# EAGLE design room_interface (EAGLE 6.4)

## Sheet 1 of 3
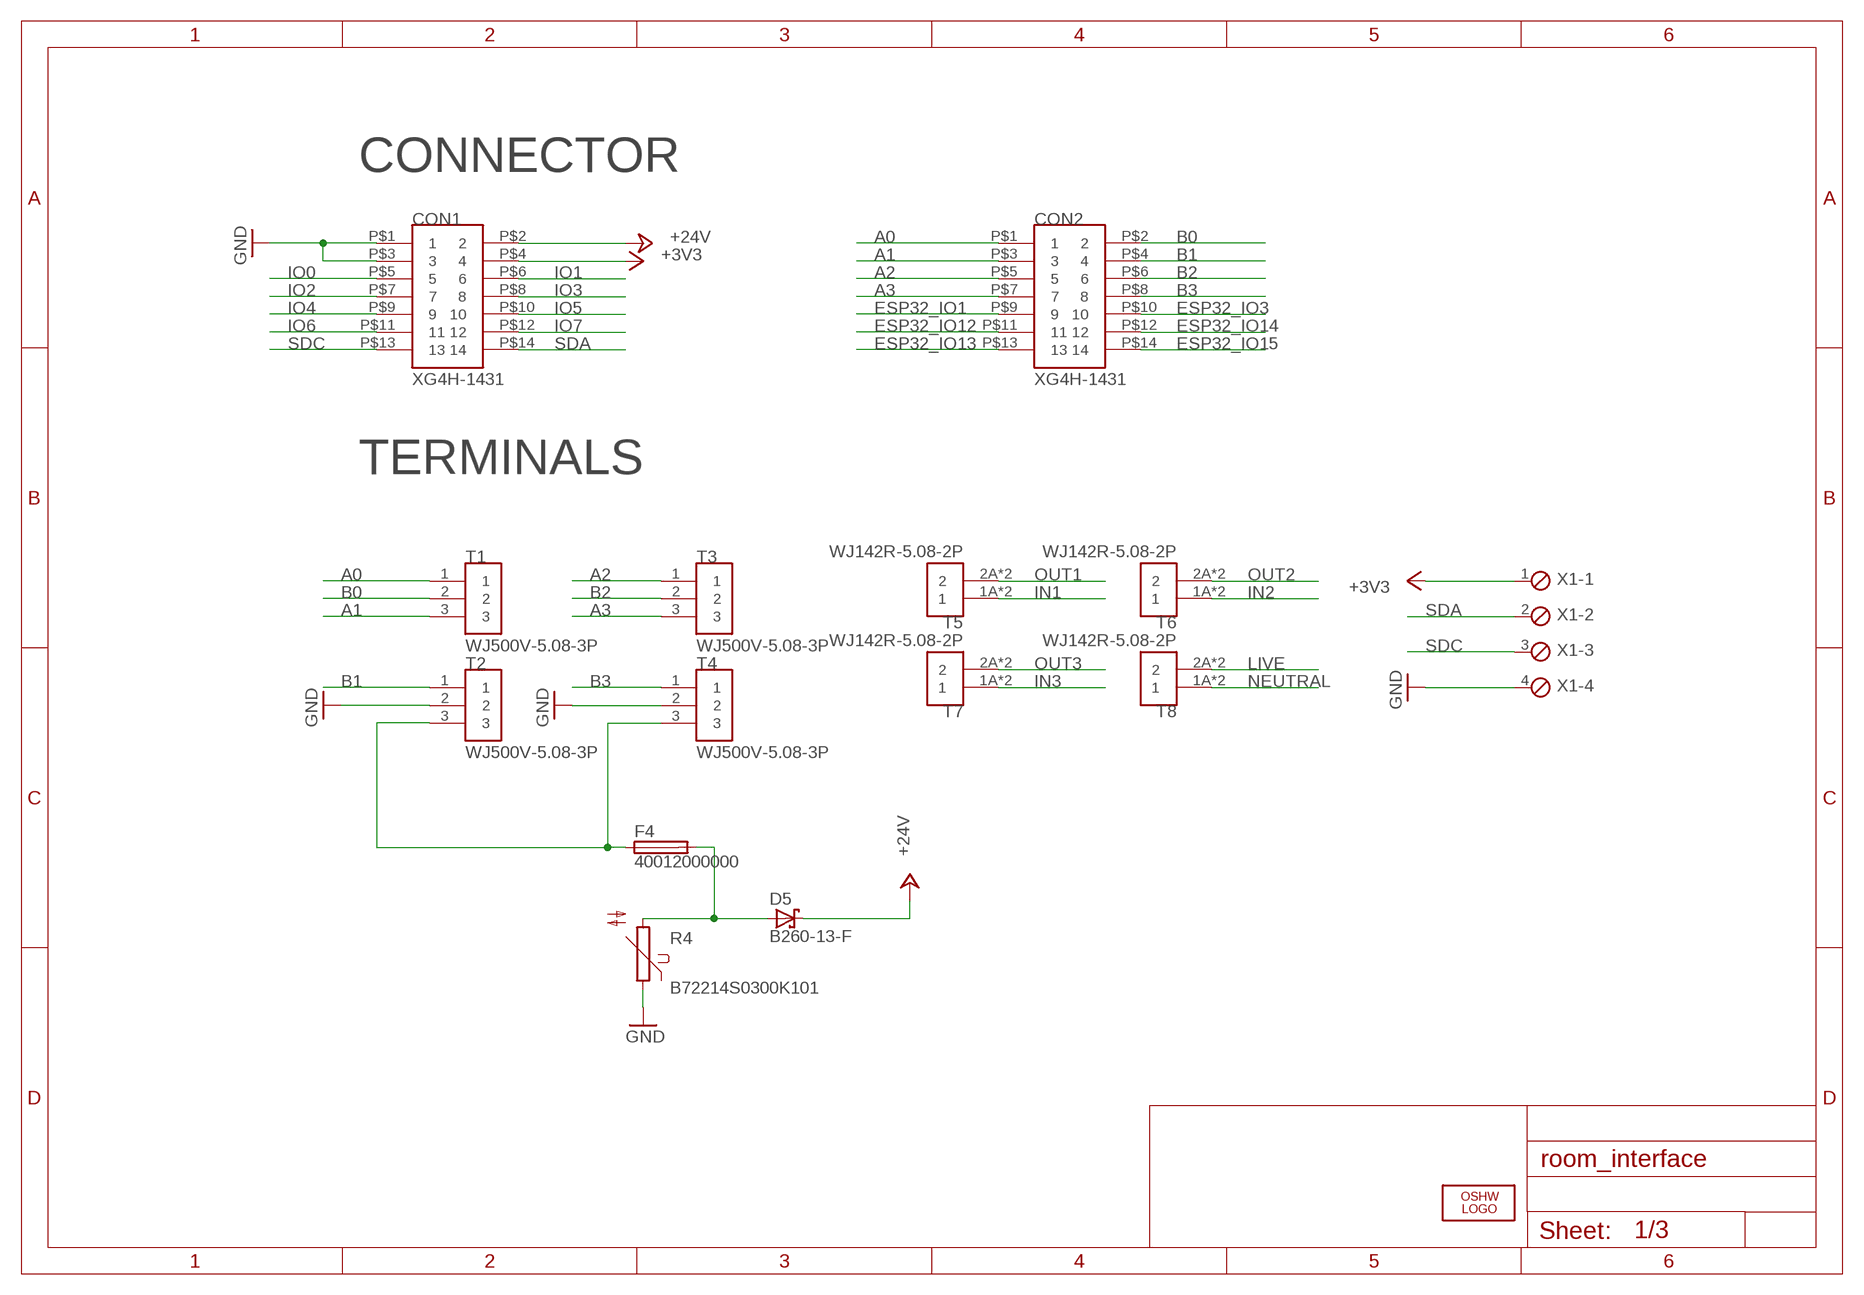
[diagram p0: schematic, sheet 1]

### Parts
CON1  XG4H-1431  [XG4H-1431]
CON2  XG4H-1431  [XG4H-1431]
D5  B260-13-F  MBRS130LT3  [SMB]
F4  40012000000  [400]
LOGO1  OSHW_LOGO_FILLX0350-NT  [OSHW_FILLX350_NOTEXT]
R4  B72214S0300K101  S14K300  [S14K300]
T1  WJ500V-5.08-3P  [WJ500V-5.08-3P]
T2  WJ500V-5.08-3P  [WJ500V-5.08-3P]
T3  WJ500V-5.08-3P  [WJ500V-5.08-3P]
T4  WJ500V-5.08-3P  [WJ500V-5.08-3P]
T5  WJ142R-5.08-2P  [WJ142R.5.08-2P]
T6  WJ142R-5.08-2P  [WJ142R.5.08-2P]
T7  WJ142R-5.08-2P  [WJ142R.5.08-2P]
T8  WJ142R-5.08-2P  [WJ142R.5.08-2P]
X1  MPT4  [4POL254]

### Nets
+3V3: CON1.P$4 X1.1 ; also sheet 3
+24V: CON1.P$2 D5.C ; also sheet 2
A0: CON2.P$1 T1.1
A1: CON2.P$3 T1.3
A2: CON2.P$5 T3.1
A3: CON2.P$7 T3.3
B0: CON2.P$2 T1.2
B1: CON2.P$4 T2.1
B2: CON2.P$6 T3.2
B3: CON2.P$8 T4.1
ESP32_IO1: CON2.P$9
ESP32_IO3: CON2.P$10
ESP32_IO12: CON2.P$11
ESP32_IO13: CON2.P$13
ESP32_IO14: CON2.P$12
ESP32_IO15: CON2.P$14
GND: CON1.P$1 CON1.P$3 R4.1 T2.2 T4.2 X1.4 ; also sheet 2,3
IN1: T5.1A T5.1B ; also sheet 3
IN2: T6.1A T6.1B ; also sheet 3
IN3: T7.1A T7.1B ; also sheet 3
IO0: CON1.P$5 ; also sheet 2
IO1: CON1.P$6 ; also sheet 2
IO2: CON1.P$7 ; also sheet 2
IO3: CON1.P$8
IO4: CON1.P$9
IO5: CON1.P$10 ; also sheet 3
IO6: CON1.P$11 ; also sheet 3
IO7: CON1.P$12 ; also sheet 3
LIVE: T8.2A T8.2B ; also sheet 2
N$4: D5.A F4.P$2 R4.2
N$6: F4.P$1 T2.3 T4.3
NEUTRAL: T8.1A T8.1B ; also sheet 3
OUT1: T5.2A T5.2B ; also sheet 2
OUT2: T6.2A T6.2B ; also sheet 2
OUT3: T7.2A T7.2B ; also sheet 2
SDA: CON1.P$14 X1.2
SDC: CON1.P$13 X1.3

### Notes on the sheet
- CONNECTOR
- TERMINALS

## Sheet 2 of 3
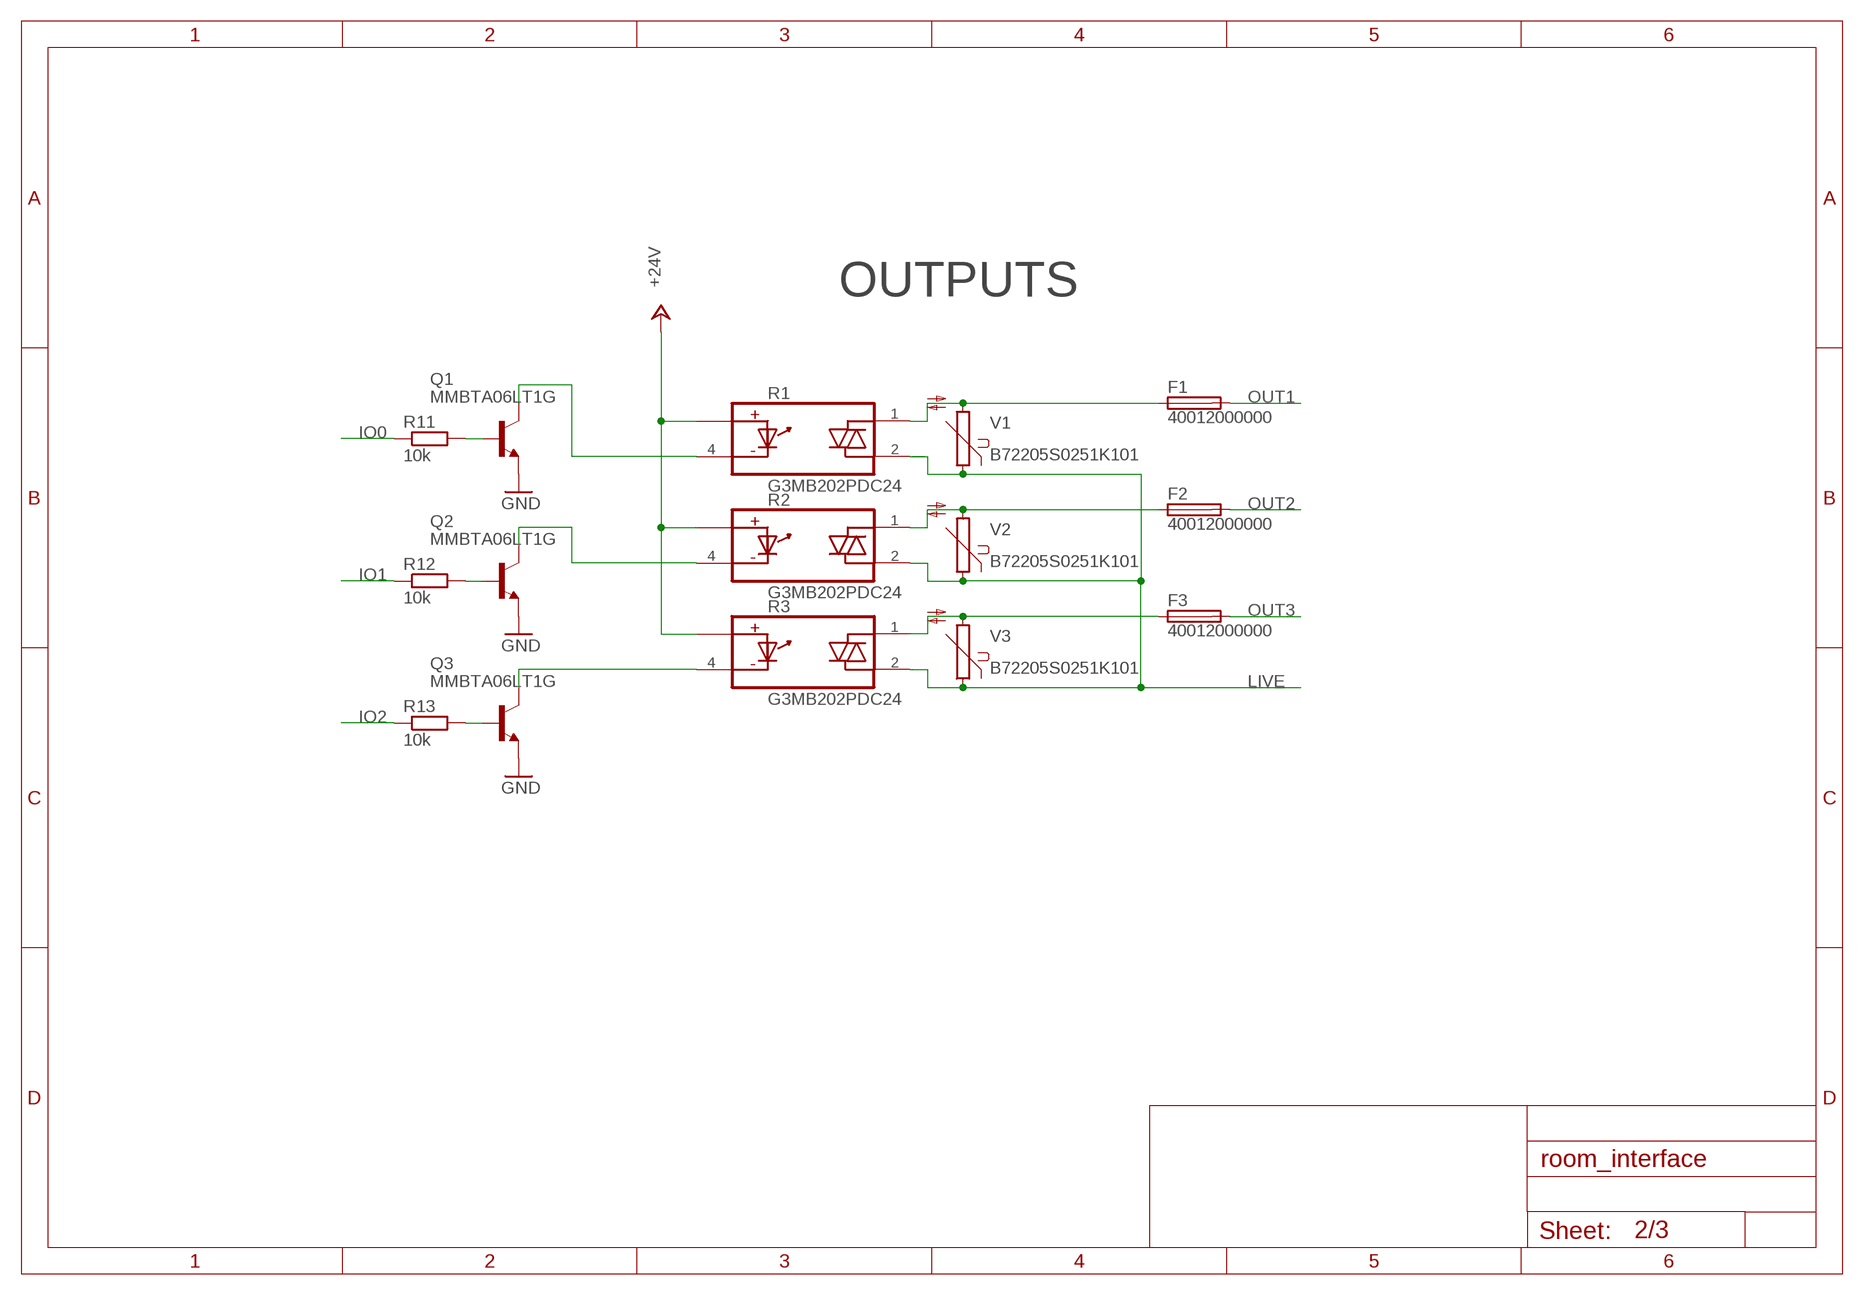
[diagram p1: schematic, sheet 2]

### Parts
F1  40012000000  [400]
F2  40012000000  [400]
F3  40012000000  [400]
Q1  MMBTA06LT1G  BC849SMD  [SOT23-BEC]
Q2  MMBTA06LT1G  BC849SMD  [SOT23-BEC]
Q3  MMBTA06LT1G  BC849SMD  [SOT23-BEC]
R1  G3MB202PDC24  RELAY_G3MB202PDC5  [RELAY_G3MB202PDC12]
R2  G3MB202PDC24  RELAY_G3MB202PDC5  [RELAY_G3MB202PDC12]
R3  G3MB202PDC24  RELAY_G3MB202PDC5  [RELAY_G3MB202PDC12]
R11  10k  R-EU_R1206  [R1206]
R12  10k  R-EU_R1206  [R1206]
R13  10k  R-EU_R1206  [R1206]
V1  B72205S0251K101  S05K250  [S05K250]
V2  B72205S0251K101  S05K250  [S05K250]
V3  B72205S0251K101  S05K250  [S05K250]

### Nets
+24V: R1.3(IN+) R2.3(IN+) R3.3(IN+) ; also sheet 1
GND: Q1.E Q2.E Q3.E ; also sheet 1,3
IO0: R11.1 ; also sheet 1
IO1: R12.1 ; also sheet 1
IO2: R13.1 ; also sheet 1
LIVE: R1.2(OUT2) R2.2(OUT2) R3.2(OUT2) V1.1 V2.1 V3.1 ; also sheet 1
N$1: F1.P$1 R1.1(OUT1) V1.2
N$2: F2.P$1 R2.1(OUT1) V2.2
N$3: F3.P$1 R3.1(OUT1) V3.2
N$12: Q1.B R11.2
N$13: Q1.C R1.4(IN-)
N$15: Q2.B R12.2
N$16: Q2.C R2.4(IN-)
N$18: Q3.B R13.2
N$19: Q3.C R3.4(IN-)
OUT1: F1.P$2 ; also sheet 1
OUT2: F2.P$2 ; also sheet 1
OUT3: F3.P$2 ; also sheet 1

### Notes on the sheet
- OUTPUTS

## Sheet 3 of 3
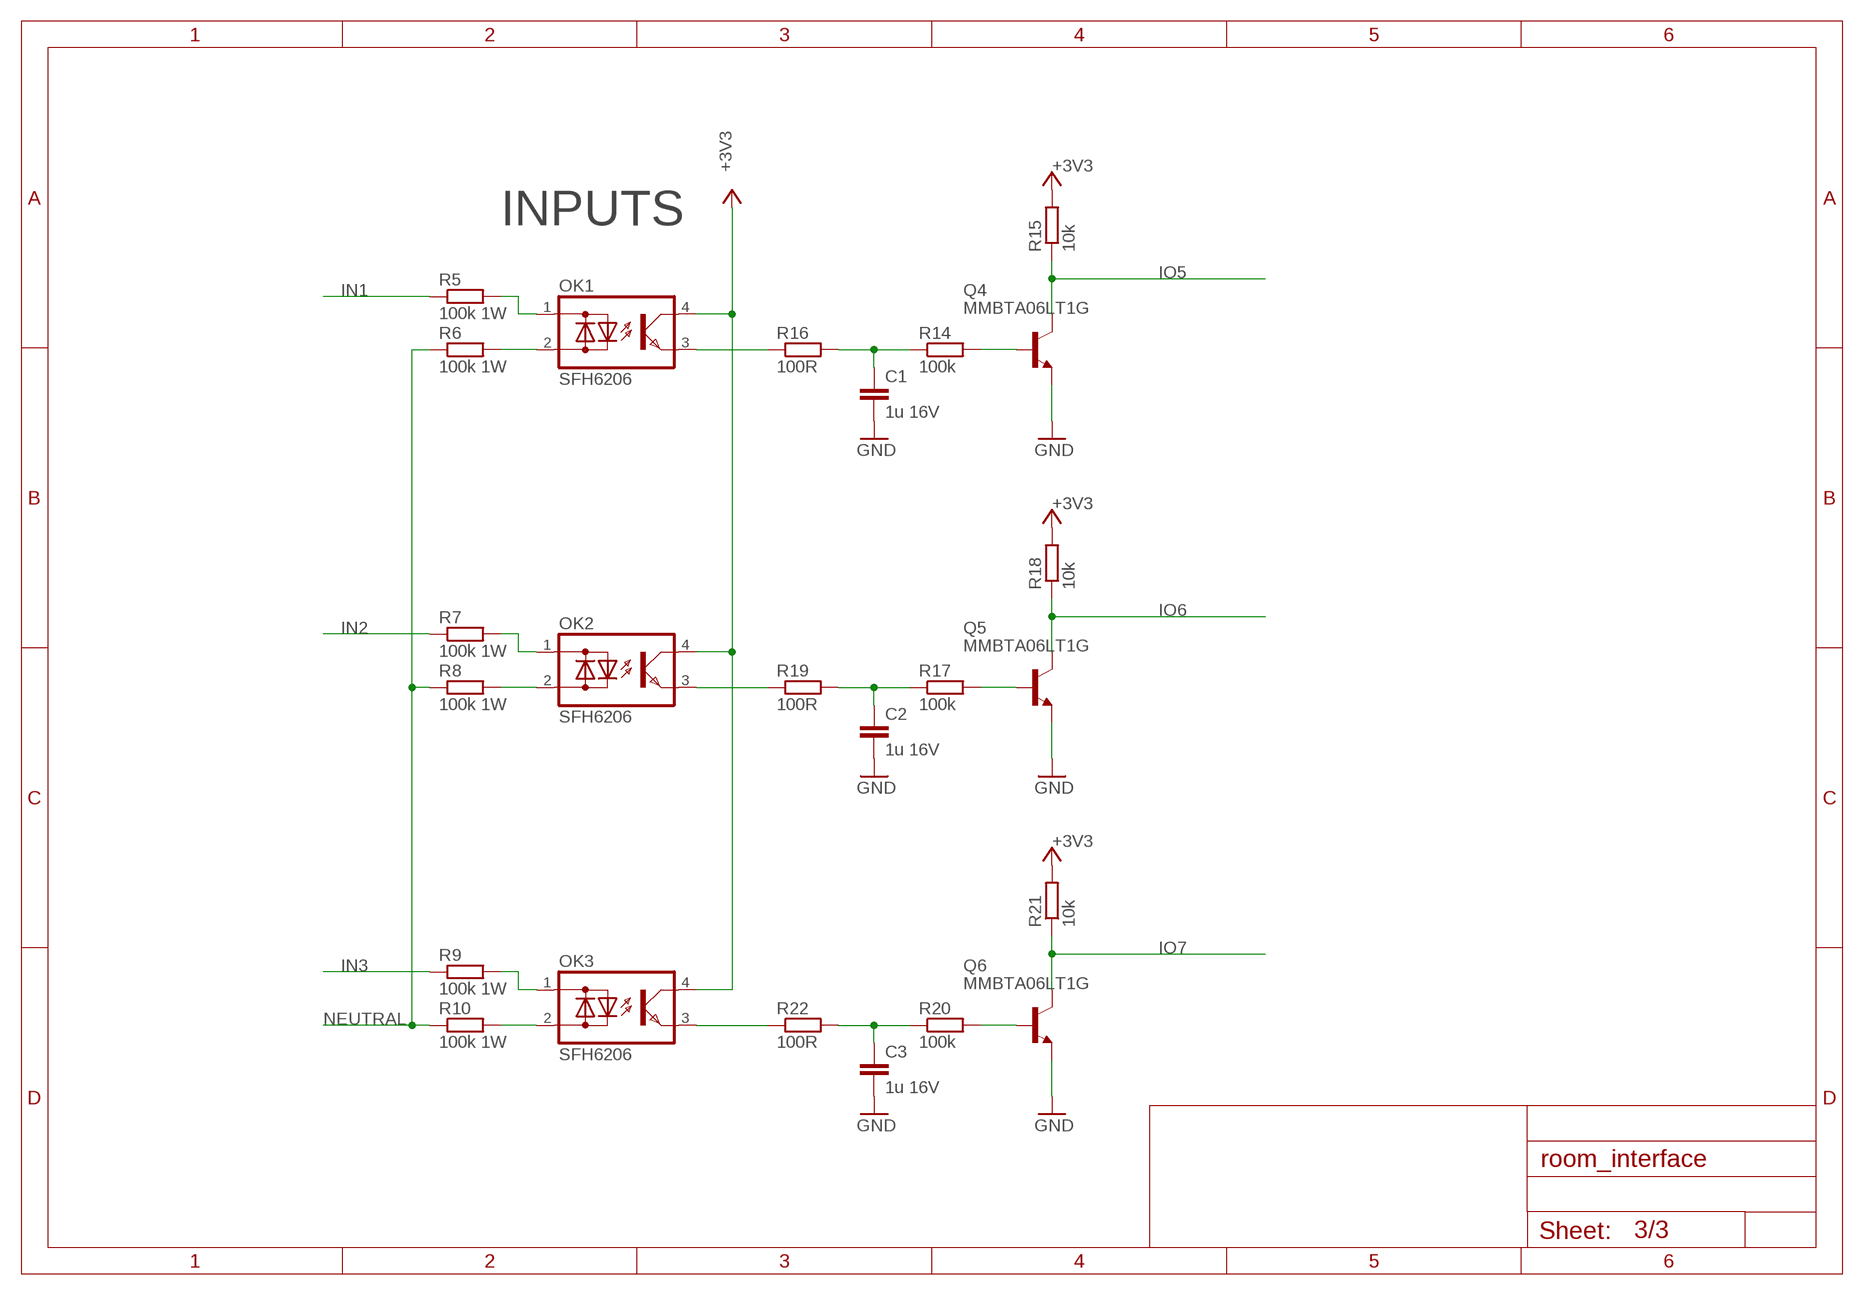
[diagram p2: schematic, sheet 3]

### Parts
C1  1u 16V  C-EUC0805  [C0805]
C2  1u 16V  C-EUC0805  [C0805]
C3  1u 16V  C-EUC0805  [C0805]
OK1  SFH6206  [DIL4-SMD]
OK2  SFH6206  [DIL4-SMD]
OK3  SFH6206  [DIL4-SMD]
Q4  MMBTA06LT1G  BC849SMD  [SOT23-BEC]
Q5  MMBTA06LT1G  BC849SMD  [SOT23-BEC]
Q6  MMBTA06LT1G  BC849SMD  [SOT23-BEC]
R5  100k 1W  R-EU_R2010  [R2010]
R6  100k 1W  R-EU_R2010  [R2010]
R7  100k 1W  R-EU_R2010  [R2010]
R8  100k 1W  R-EU_R2010  [R2010]
R9  100k 1W  R-EU_R2010  [R2010]
R10  100k 1W  R-EU_R2010  [R2010]
R14  100k  R-EU_R1206  [R1206]
R15  10k  R-EU_R1206  [R1206]
R16  100R  R-EU_R1206  [R1206]
R17  100k  R-EU_R1206  [R1206]
R18  10k  R-EU_R1206  [R1206]
R19  100R  R-EU_R1206  [R1206]
R20  100k  R-EU_R1206  [R1206]
R21  10k  R-EU_R1206  [R1206]
R22  100R  R-EU_R1206  [R1206]

### Nets
+3V3: OK1.4(C) OK2.4(C) OK3.4(C) R15.2 R18.2 R21.2 ; also sheet 1
GND: C1.2 C2.2 C3.2 Q4.E Q5.E Q6.E ; also sheet 1,2
IN1: R5.1 ; also sheet 1
IN2: R7.1 ; also sheet 1
IN3: R9.1 ; also sheet 1
IO5: Q4.C R15.1 ; also sheet 1
IO6: Q5.C R18.1 ; also sheet 1
IO7: Q6.C R21.1 ; also sheet 1
N$5: OK1.2(AC2) R6.2
N$7: OK1.1(AC1) R5.2
N$8: OK2.1(AC1) R7.2
N$9: OK2.2(AC2) R8.2
N$10: OK3.1(AC1) R9.2
N$11: OK3.2(AC2) R10.2
N$17: Q4.B R14.2
N$20: OK1.3(E) R16.1
N$21: C1.1 R14.1 R16.2
N$23: Q5.B R17.2
N$24: OK2.3(E) R19.1
N$25: C2.1 R17.1 R19.2
N$27: Q6.B R20.2
N$28: OK3.3(E) R22.1
N$29: C3.1 R20.1 R22.2
NEUTRAL: R6.1 R8.1 R10.1 ; also sheet 1

### Notes on the sheet
- INPUTS

## Library data of the parts
C1-C3 = rcl:C-EU: CAPACITOR, European symbol
CON1 CON2 = parts:XG4H-1431
D5 = diode:MBRS130LT3: Schottky Power Rectifier Source: http://www.onsemi.com/pub/Collateral/MBRS130LT3-D.PDF
F1-F4 = 400XXX0000:40012000000
LOGO1 = ohw-logo:OSHW_LOGO_FILL
OK1-OK3 = optocoupler:SFH620: Optocoupler, Phototransistor Output, AC Input Source: http://www.vishay.com/docs/83675/sfh620.pdf; MF: VISHAY/TELEFUNKEN; MPN: SFH6206-3; OC_FARNELL: 1469585; OC_NEWARK: 58K2214
Q1-Q6 = transistor-npn:BC849*: NPN Transistor
R1-R3 = RELAY_G3MB202PDC5_snapEDA:RELAY_G3MB202PDC5
R4 = varistor:S14K300: VARISTOR
R5-R22 = rcl:R-EU_: RESISTOR, European symbol
T1-T4 = parts:WJ500V-5.08-3P
T5-T8 = parts:WJ142R-5.08-2P
V1-V3 = varistor:S05K250: VARISTOR
X1 = con-phoenix-254:MPT4: PHOENIX CONNECTOR; OC_FARNELL: unknown; OC_NEWARK: unknown

## Board
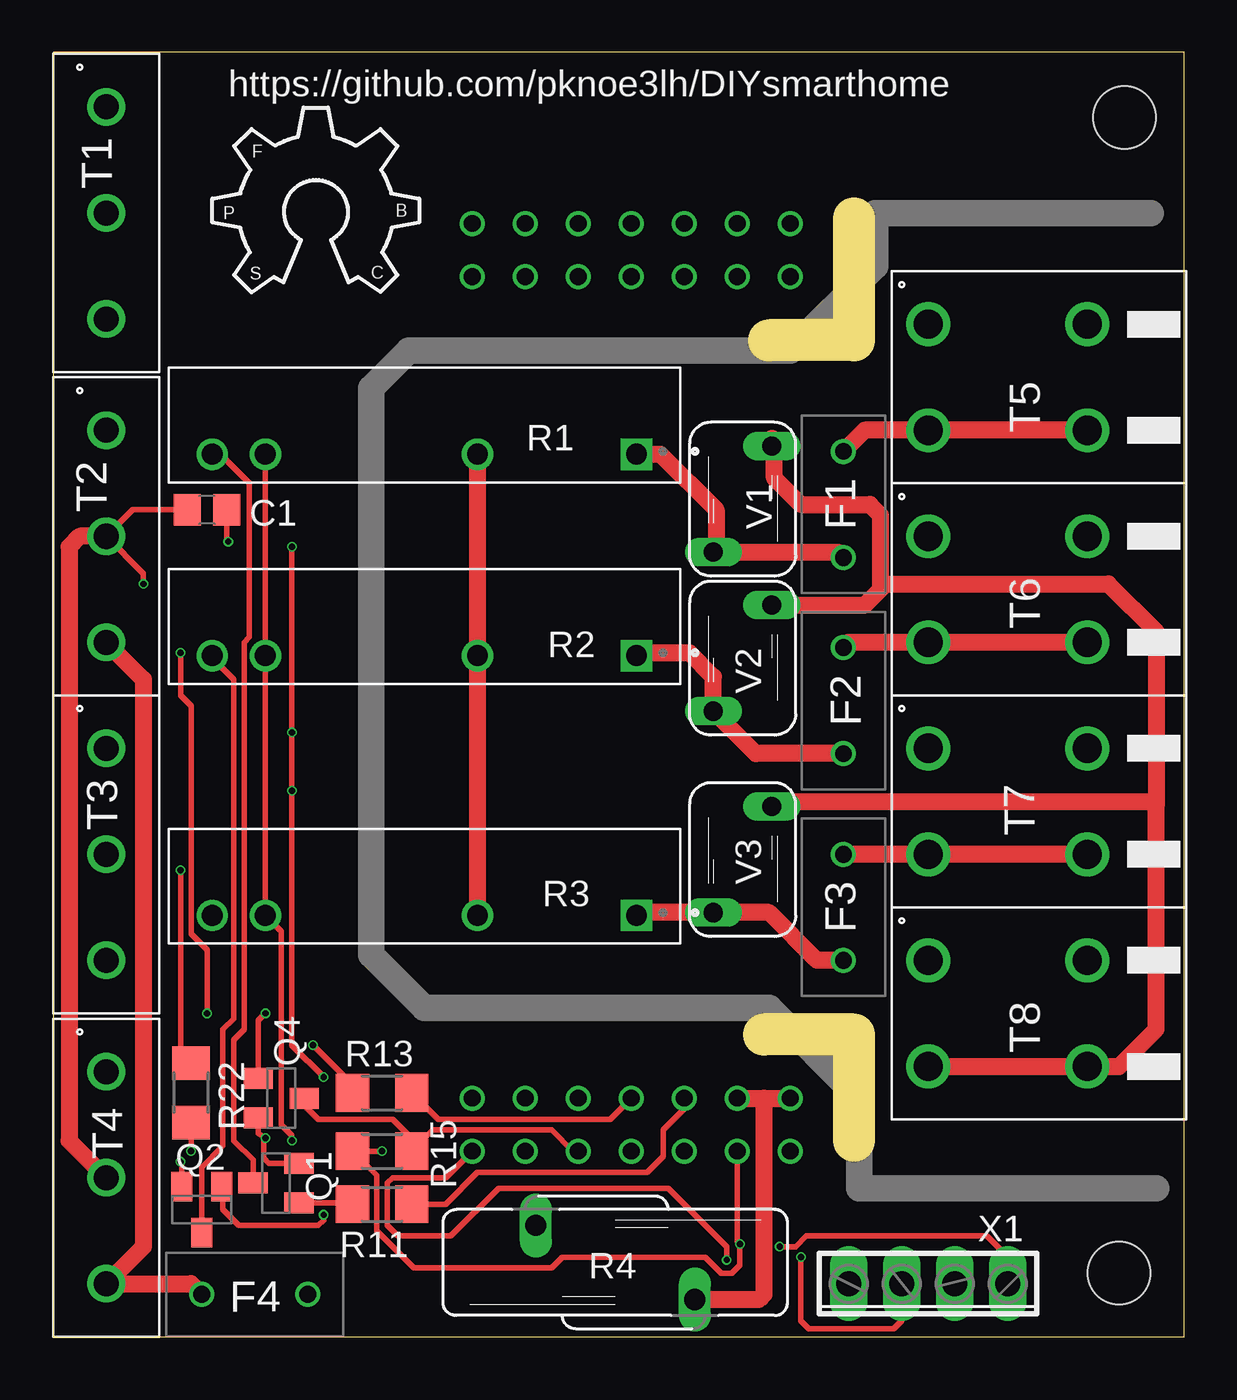
[diagram p3: board, top side]
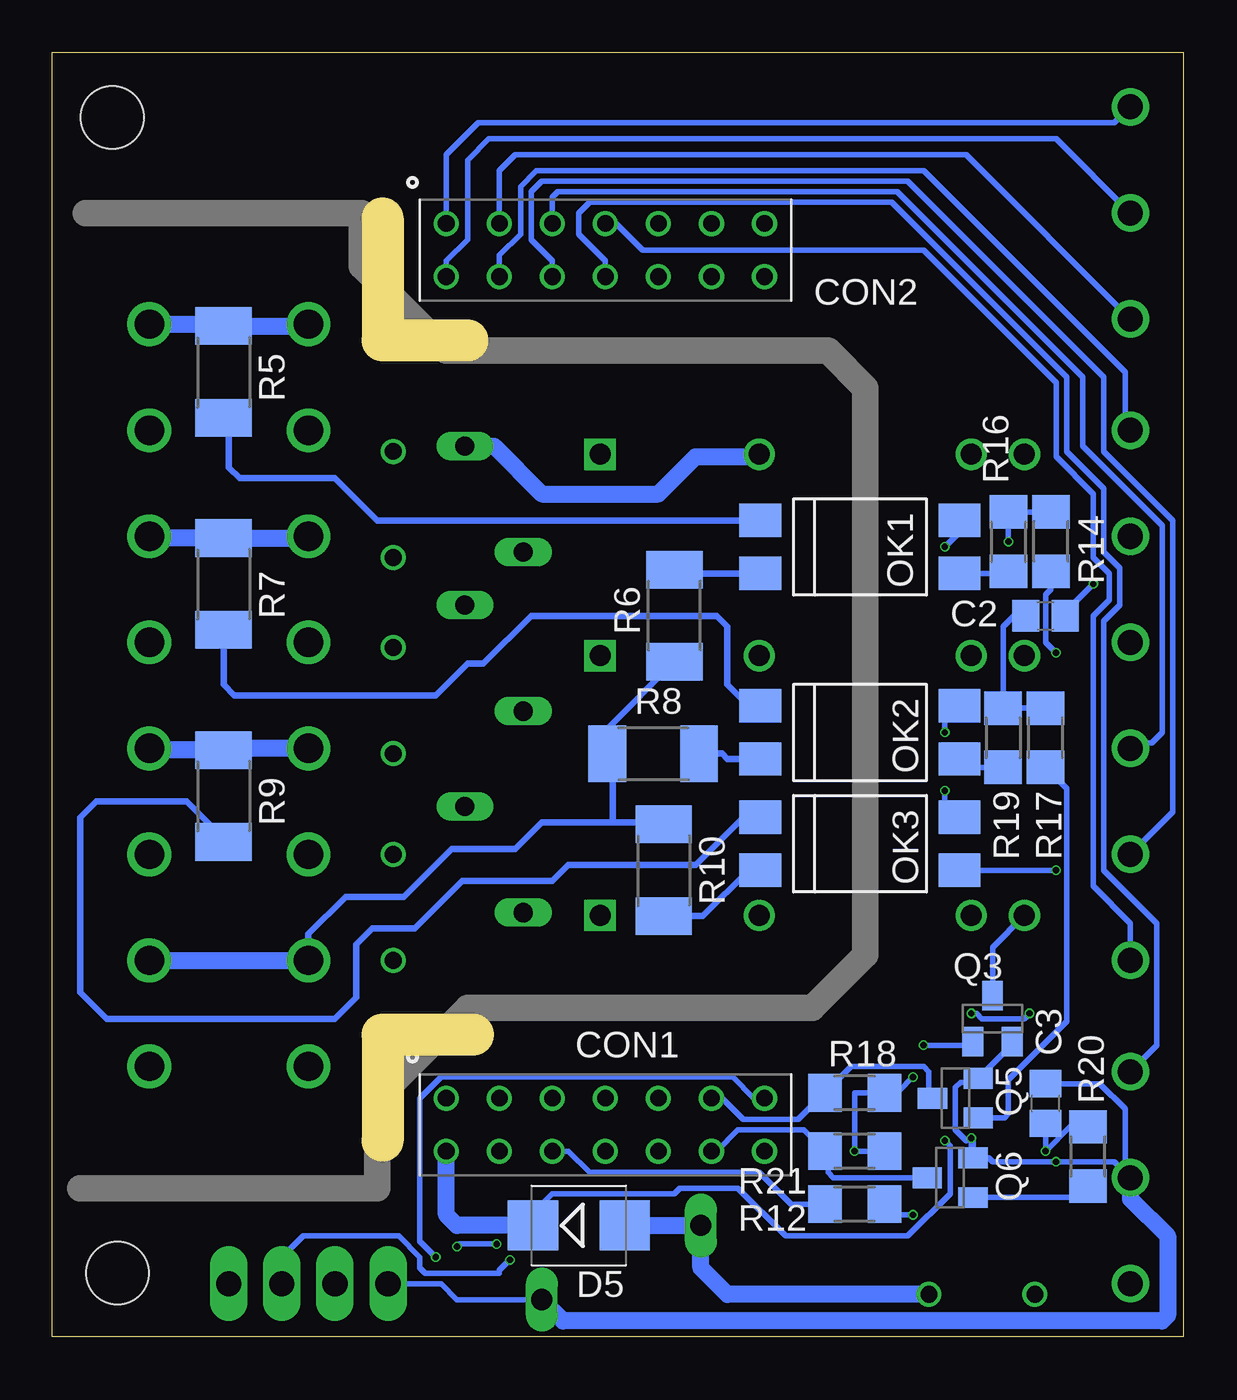
[diagram p4: board, bottom side, seen from below]

Size 54.19 x 61.55 mm. Coordinates in mm from the lower left corner, seen from the top.
Outline: 0,0 54.19,0 54.19,61.55 0,61.55 0,0
Copper layers (1*16): Top 0.035559375mm / dielectric 1.6mm / Bottom 0.035559375mm
Design rules "jlcpcb2layer": minimum track width 5mil, minimum drill 12mil, track to track 5mil, track to pad 5mil, pad to pad 5mil, via to via 5mil, smd to smd 5mil, copper to edge 8mil, drill to drill 6mil, minimum pad ring 5mil, minimum via ring 3mil, stop-mask expansion 2.5mil, vias tented up to drill 0mil, thermal gap 10mil
Holes 3 mm at 51.31,58.42 51.05,3.05
Milling: 4 lines

### Footprints (pad centres in the part's own frame; a part is rotated, then mirrored left to right if it is on the bottom)
C0805 = smd 1.3 x 1.5: 1 -0.95,0; 2 0.95,0
XG4H-1431 = drill 0.8: P$1 -7.62,1.27; P$2 -7.62,-1.27; P$3 -5.08,1.27; P$4 -5.08,-1.27; P$5 -2.54,1.27; P$6 -2.54,-1.27; P$7 0,1.27; P$8 0,-1.27; P$9 2.54,1.27; P$10 2.54,-1.27; P$11 5.08,1.27; P$12 5.08,-1.27; P$13 7.62,1.27; P$14 7.62,-1.27
SMB = smd 2.4 x 2.4: A 2.2,0; C -2.2,0
400 = drill 0.8: P$1 -2.54,0; P$2 2.54,0
DIL4-SMD = smd 1.6 x 2: 1 -1.27,-4.77; 2 1.27,-4.77; 3 1.27,4.77; 4 -1.27,4.77
SOT23-BEC = smd 1 x 1.4: B -0.95,-1.1; C 0,1.1; E 0.95,-1.1
RELAY_G3MB202PDC12 = drill 1 square: 1 -10.16,1.4 | drill 1: 2 -2.54,1.4; 3 7.62,1.4; 4 10.16,1.4
S14K300 = drill 1.016 long: 1 -1.778,-3.81; 2 1.778,3.81
R2010 = smd 1.8 x 2.7: 1 -2.2,0; 2 2.2,0
R1206 = smd 1.6 x 1.803: 1 -1.422,0; 2 1.422,0
WJ500V-5.08-3P = drill 1.2: 1 -5.08,0; 2 0,0; 3 5.08,0
WJ142R.5.08-2P = drill 1.4: 1A -2.54,-3.81; 1B -2.54,3.81; 2A 2.54,-3.81; 2B 2.54,3.81
S05K250 = drill 0.914 long: 1 -1.397,-2.54; 2 1.397,2.54
4POL254 = drill 1.2 long: 1 -3.81,0; 2 -1.27,0; 3 1.27,0; 4 3.81,0

### Placement (x,y rotation side)
C1  7.37,39.62 180 top
C2  6.6,34.54 0 bottom
C3  6.6,11.18 90 bottom
CON1  27.69,10.16 0 bottom
CON2  27.69,52.07 0 bottom
D5  28.96,5.33 0 bottom
F1  37.85,39.88 90 top
F2  37.85,30.48 90 top
F3  37.85,20.57 90 top
F4  9.65,2.03 0 top
LOGO1  7.62,50.04 0 top
OK1  15.49,37.85 270 bottom
OK2  15.49,28.96 270 bottom
OK3  15.49,23.62 270 bottom
Q1  10.67,7.37 90 top
Q2  7.11,6.1 180 top
Q3  9.14,15.24 0 bottom
Q4  10.92,11.43 270 top
Q5  10.92,11.43 90 bottom
Q6  11.18,7.62 90 bottom
R1  17.78,43.69 180 top
R2  17.78,34.04 180 top
R3  17.78,21.59 180 top
R4  26.92,3.56 90 top
R5  45.97,46.23 270 bottom
R6  24.38,34.54 90 bottom
R7  45.97,36.07 270 bottom
R8  25.4,27.94 0 bottom
R9  45.97,25.91 270 bottom
R10  24.89,22.35 270 bottom
R11  15.75,6.35 180 top
R12  15.75,6.35 0 bottom
R13  15.75,11.68 180 top
R14  6.35,38.1 270 bottom
R15  15.75,8.89 180 top
R16  8.38,38.1 90 bottom
R17  6.6,28.7 270 bottom
R18  15.75,11.68 0 bottom
R19  8.64,28.7 90 bottom
R20  4.57,8.64 270 bottom
R21  15.75,8.89 0 bottom
R22  6.6,11.68 270 top
T1  2.54,53.85 270 top
T2  2.54,38.35 270 top
T3  2.54,23.11 270 top
T4  2.54,7.62 270 top
T5  45.72,45.97 270 top
T6  45.72,35.81 270 top
T7  45.72,25.65 270 top
T8  45.72,15.49 270 top
V1  33.02,40.13 180 top
V2  33.02,32.51 180 top
V3  33.02,22.86 180 top
X1  41.91,2.54 180 top

### Tracks (layer width: path | path; a pad name or v marks a point on that pad's centre or on a via)
+3V3  (via drill 0.3)
  Top 0.254: v34.8,4.32 35.56,4.32 36.07,4.83 44.7,4.83 45.97,3.56 45.97,2.79 X1.1 | CON1.P$4 32.77,4.57 v32.89,4.44 32.89,3.43 32.51,3.05 32,3.05 31.24,3.81 24.38,3.81 23.88,3.3 17.27,3.3 15.49,5.08 15.49,7.72 R21.2 v15.75,8.89 | v11.43,37.85 v11.43,28.96 11.43,26.92 v11.43,26.16 11.43,13.97 v12.95,12.45
  Bottom 0.254: v32.89,4.44 34.67,4.44 v34.8,4.32 | R21.2 v15.75,8.89 15.75,11.68 R18.2 14.22,11.79 13.61,11.79 v12.95,12.45 | OK1.4 10.72,38.55 v11.43,37.85 | v11.43,28.96 11.43,29.52 OK2.4 | v11.43,26.16 11.43,25.6 OK3.4
+24V  (via drill 0.3)
  Top 0.254: v11.43,9.4 11.43,9.65 10.92,10.16 10.92,19.43 R3.3 R2.3 R1.3
  Bottom 0.254: D5.C 31.16,5.93 30.23,6.86 24.38,6.86 24.13,7.11 21.34,7.11 19.05,4.83 13.21,4.83 11.18,6.86 11.18,9.14 v11.43,9.4
  Bottom 0.813: D5.C 34.8,5.33 35.31,5.84 CON1.P$2
A0
  Bottom 0.254: CON2.P$1 35.31,56.64 33.78,58.17 3.3,58.17 T1.1
A1
  Bottom 0.254: CON2.P$3 32.77,55.88 32,56.64 10.41,56.64 T1.3
A2
  Bottom 0.254: CON2.P$5 30.23,54.61 29.97,54.86 13.72,54.86 4.83,45.97 4.83,42.67 1.02,38.86 1.02,28.96 1.52,28.45 2.29,28.45 T3.1
A3
  Bottom 0.254: CON2.P$7 27.18,53.34 25.91,52.07 12.45,52.07 6.1,45.72 6.1,42.16 4.32,40.39 4.32,37.34 3.56,36.58 3.56,35.31 4.32,34.54 4.32,21.59 2.54,19.81 T3.3
B0
  Bottom 0.254: CON2.P$2 35.31,51.56 34.29,52.58 34.29,56.39 33.27,57.4 6.1,57.4 T1.2
B1
  Bottom 0.254: T2.1 2.79,43.69 2.79,46.23 12.45,55.88 30.99,55.88 31.75,55.12 31.75,52.83 32.77,51.82 CON2.P$4
B2
  Bottom 0.254: CON2.P$6 30.23,51.56 31.24,52.58 31.24,54.86 30.73,55.37 13.21,55.37 3.81,45.97 3.81,42.42 0.51,39.12 0.51,25.15 T3.2
B3
  Bottom 0.254: T4.1 1.27,13.97 1.27,19.81 3.81,22.35 3.81,34.29 3.05,35.05 3.05,36.83 3.81,37.59 3.81,40.64 5.59,42.42 5.59,45.97 13.97,54.36 28.45,54.36 28.96,53.85 28.96,52.83 27.69,51.56 CON2.P$8
GND  (via drill 0.3)
  Top 0.254: T2.2 2.54,38.1 | Q4.E 9.82,9.74 v10.16,9.53 10.08,9.44 Q6.E 10.33,8.32 Q1.E | Q2.E 6.16,8.32 v6.1,8.38 | C1.2 3.81,39.62 T2.2 | v4.32,36.07 4.32,36.58 T2.2
  Top 0.813: T2.2 1.27,38.35 0.76,37.85 0.76,9.4 T4.2 | CON1.P$3 34.04,11.43 | 34.04,11.43 CON1.P$1 | 34.04,11.43 34.04,2.03 33.78,1.78 R4.1
  Bottom 0.254: X1.4 35.56,2.54 34.8,1.78 R4.1 | v10.16,9.53 10.16,8.65 Q6.E | Q6.E 10.08,9.31 v10.16,9.53 | v10.16,9.53 10.41,9.4 10.92,9.91 10.92,11.94 10.67,12.19 10.01,12.19 Q5.E 8.19,14.01 Q3.E | Q6.E 9.33,8.57 9.14,8.38 v6.1,8.38 3.3,8.38 T4.2 2.79,7.87 2.79,10.92 4,12.13 C3.2 | C2.2 5.65,34.73 v4.32,36.07
  Bottom 0.813: T4.2 2.54,6.6 0.76,4.83 0.76,1.02 1.02,0.76 29.72,0.76 R4.1
IN1
  Bottom 0.813: T5.1B 46.06,48.51 R5.1 42,48.43 T5.1A
IN2
  Bottom 0.813: T6.1B 49.44,38.27 R7.1 42,38.27 T6.1A
IN3
  Bottom 0.813: T7.1A 45.89,28.19 R9.1 49.44,28.11 T7.1B
IO0
  Top 0.254: CON1.P$5 30.23,10.92 29.21,9.91 29.21,8.64 28.45,7.87 20.32,7.87 18.8,6.35 R11.1
IO1
  Bottom 0.254: CON1.P$6 29.46,8.89 28.45,7.87 20.32,7.87 18.8,6.35 R12.1
IO2
  Top 0.254: CON1.P$7 26.67,10.41 18.44,10.41 R13.1
IO5
  Top 0.254: CON1.P$10 24.89,8.89 23.88,9.91 18.19,9.91 R15.1 17.02,9.04 17.02,9.65 16.26,10.41 12.7,10.41 12.02,11.09 Q4.C
IO6
  Bottom 0.254: CON1.P$11 22.1,11.43 21.08,10.41 18.44,10.41 R18.1 15.9,12.95 12.45,12.95 12.19,12.7 12.19,11.6 Q5.C 12.02,11.77
IO7
  Bottom 0.254: CON1.P$12 22.35,8.89 21.34,9.91 18.19,9.91 R21.1 17.02,8.74 17.02,7.87 16.76,7.62 Q6.C
LIVE
  Top 0.813: R1.2 R2.2 R3.2 | T8.2A T8.2B 51.05,12.95 52.83,14.73 52.83,25.4 | 52.83,25.4 52.58,25.65 34.67,25.65 V3.1 | 34.42,43.05 V1.1 34.54,42.54 34.54,41.15 35.81,39.88 39.12,39.88 39.62,39.37 39.62,36.07 39.75,35.94 | 52.83,25.4 52.83,33.78 50.55,36.07 39.88,36.07 39.75,35.94 | V2.1 38.86,35.05 39.75,35.94
  Bottom 0.813: V1.1 33.02,42.67 30.73,40.39 25.15,40.39 23.37,42.16 20.44,42.16 R1.2
N$1
  Top 0.813: R1.1 29.09,42.29 31.75,39.62 31.75,37.72 V1.2 37.59,37.59 F1.P$1
N$2
  Top 0.813: F2.P$1 33.66,27.94 V2.2 31.62,31.62 30.48,32.77 28.07,32.77 R2.1
N$3
  Top 0.813: F3.P$1 36.58,18.03 34.29,20.32 V3.2 28.07,20.32 R3.1
N$4
  Bottom 0.813: D5.A R4.2 23.11,3.3 21.84,2.03 F4.P$2
N$5
  Bottom 0.305: OK1.2 24.22,36.58
  Bottom 0.813: 24.22,36.58 R6.2
N$6
  Top 0.813: T2.3 4.32,31.5 4.32,4.32 T4.3 6.6,2.54 F4.P$1
N$7
  Bottom 0.305: OK1.1 38.61,39.12 40.64,41.15 45.21,41.15 45.72,41.66 45.72,43.77
  Bottom 0.813: 45.72,43.77 R5.2
N$8
  Bottom 0.305: 20.83,30.23 21.84,31.24 21.84,34.04 22.35,34.54 31.24,34.54 33.53,32.26 34.29,32.26 35.43,31.11 35.56,30.99 35.81,30.73 45.47,30.73 45.97,31.24 R7.2
  Bottom 0.813: OK2.1 20.83,30.23
N$9
  Bottom 0.305: R8.2 22.1,27.94 21.84,27.69 OK2.2
N$10
  Bottom 0.305: OK3.1 21.08,24.89 23.37,22.61 29.46,22.61 30.23,21.84 34.54,21.84 36.83,19.56 38.86,19.56 39.62,18.8 39.62,16.26 40.64,15.24 51.56,15.24 52.83,16.51 52.83,24.89 52.07,25.65 47.75,25.65 45.97,23.88
  Bottom 0.813: R9.2 45.97,23.88
N$11
  Bottom 0.305: R10.2 23.03,20.15 20.83,22.35
  Bottom 0.813: 20.52,22.61 OK3.2 20.83,22.35
N$12
  Top 0.254: Q1.B 14.26,6.42 R11.2
N$13
  Top 0.254: Q1.C 9.57,8.47 8.64,9.4 8.64,14.22 9.14,14.73 9.14,33.27 9.4,33.53 9.4,40.89 8,42.29 R1.4
N$15  (via drill 0.3)
  Top 0.254: v12.95,5.84 12.95,5.59 12.7,5.33 8.89,5.33 8.13,6.1 8.13,7.13 Q2.B
  Bottom 0.254: R12.2 14.33,6.2 13.97,5.84 v12.95,5.84
N$16
  Top 0.254: R2.4 7.62,32.51 8.64,31.5 8.64,15.24 8.13,14.73 8.13,9.14 7.11,8.13 Q2.C
N$17  (via drill 0.3)
  Top 0.254: Q4.B 9.82,15.16 v10.16,15.49 | v7.37,15.49 7.37,18.54 6.6,19.3 6.6,30.23 6.1,30.73 v6.1,32.77
  Bottom 0.254: v10.16,15.49 9.91,15.49 9.65,15.24 7.62,15.24 v7.37,15.49 | R14.2 6.35,35.81 6.6,35.56 6.6,33.27 v6.1,32.77
N$18  (via drill 0.3)
  Top 0.254: R13.2 14.33,12.09 v12.45,13.97
  Bottom 0.254: v12.45,13.97 10.41,13.97 | 10.41,13.97 9.91,13.97 | Q3.B 10.24,14.14 10.41,13.97
N$19
  Bottom 0.254: Q3.C 9.14,18.67 R3.4
N$20
  Bottom 0.254: OK1.3 8.48,36.58 R16.1
N$21  (via drill 0.3)
  Top 0.254: C1.1 8.32,38.17 v8.38,38.1
  Bottom 0.254: R14.1 R16.2 v8.38,38.1
N$23
  Bottom 0.254: Q5.B 8.57,10.48 8.38,10.67 8.38,12.32 5.59,15.11 5.59,26.26 R17.2
N$24
  Bottom 0.254: R19.1 10.32,27.28 OK2.3
N$25
  Bottom 0.254: R17.1 R19.2 8.64,34.04 8.13,34.54 C2.1
N$27
  Bottom 0.254: Q6.B 5.12,6.67 R20.2
N$28  (via drill 0.3)
  Top 0.254: v6.1,22.35 6.1,13.61 R22.1
  Bottom 0.254: v6.1,22.35 OK3.3
N$29  (via drill 0.3)
  Top 0.254: v6.6,8.89 R22.2 6.6,10.48
  Bottom 0.254: R20.1 5.44,10.06 v6.6,8.89 C3.1
NEUTRAL
  Bottom 0.305: R8.1 27.6,29.13 R6.1 | T8.1A 41.91,19.3 40.13,21.08 37.34,21.08 35.05,23.37 32,23.37 30.73,24.64 27.43,24.64 | 27.43,24.64 24.98,24.64 | 27.35,27.69 27.35,24.72 27.43,24.64
  Bottom 0.813: T8.1B T8.1A | 27.35,27.69 R8.1 | 24.98,24.64 R10.1
OUT1
  Top 0.813: T5.2B T5.2A 38.86,43.43 F1.P$2
OUT2
  Top 0.813: T6.2B T6.2A 38.1,33.27 F2.P$2
OUT3
  Top 0.813: T7.2B T7.2A F3.P$2
SDA  (via drill 0.3)
  Top 0.254: CON1.P$14 18.8,7.62 16.26,7.62 16,7.37 16,5.33 16.51,4.83 19.05,4.83 21.34,7.11 29.46,7.11 32.26,4.32 v32.26,3.68
  Bottom 0.254: X1.2 43.18,3.81 42.16,4.83 37.59,4.83 36.58,3.81 36.58,3.3 36.32,3.05 32.77,3.05 32.77,3.17 v32.26,3.68
SDC  (via drill 0.3)
  Top 0.254: v35.81,3.81 35.81,0.76 36.2,0.38 40.26,0.38 40.64,0.76 X1.3
  Bottom 0.254: CON1.P$13 20.57,11.43 21.59,12.45 35.56,12.45 36.58,11.43 36.58,4.57 v35.81,3.81

### Text on the board
tPlace: https://github.com/pknoe3lh/DIYsmarthome